# EAGLE design myUZE_final (EAGLE 7.5.0)
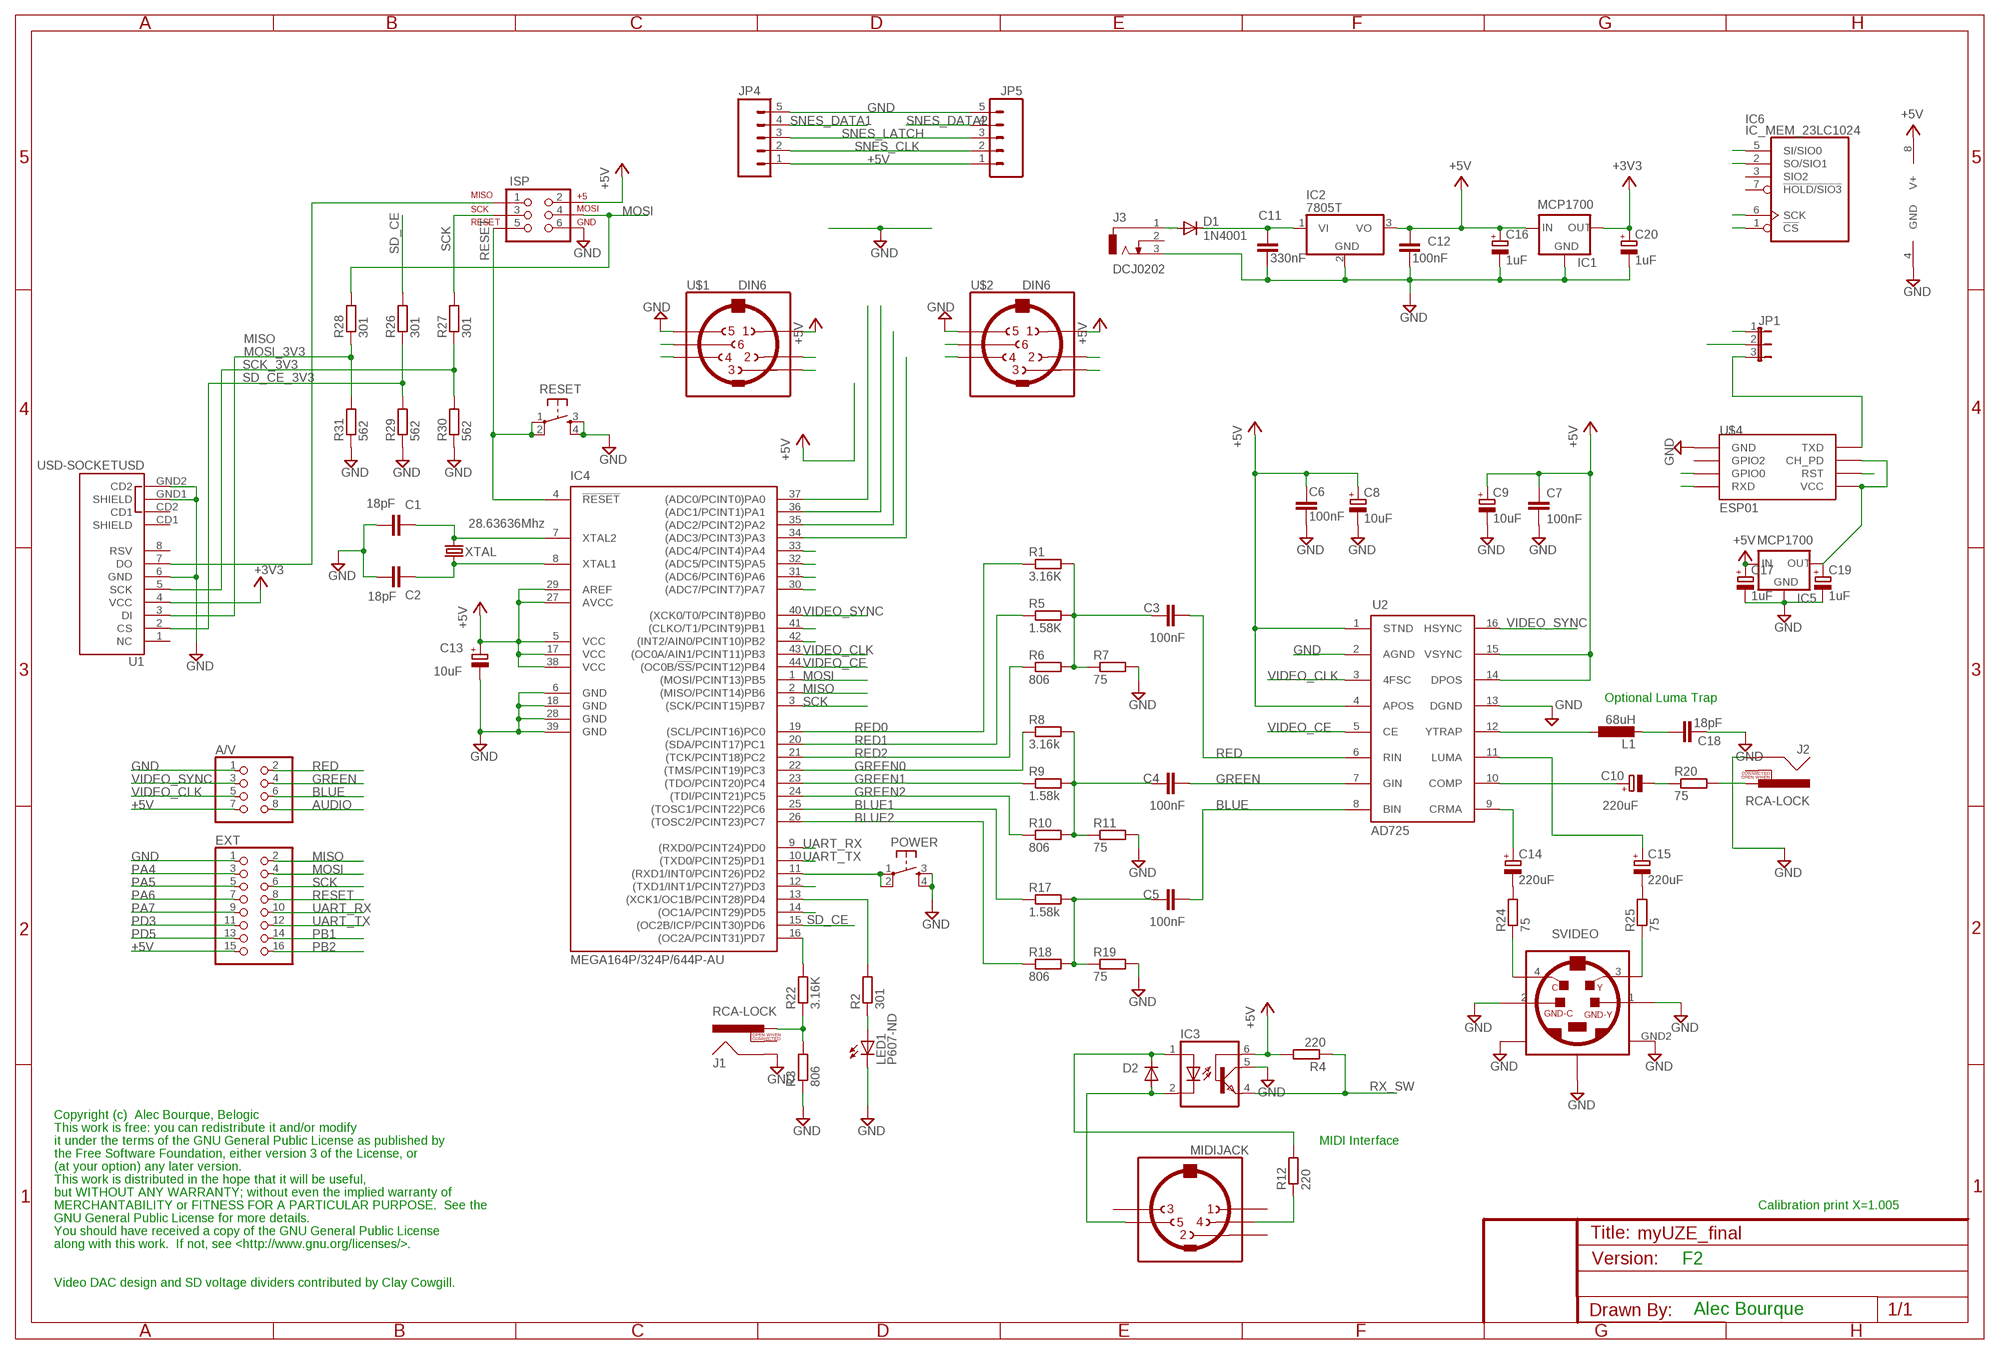
[diagram p0: schematic, sheet 1]

## Parts
A/V  PINHD-2X4  [2X04]
AD725  AD725  [SO16W]
C1  18pF  C-EUC0805  [C0805]
C2  18pF  C-EUC0805  [C0805]
C3  100nF  C-EUC0805  [C0805]
C4  100nF  C-EUC0805  [C0805]
C5  100nF  C-EUC0805  [C0805]
C6  100nF  C-EUC0805  [C0805]
C7  100nF  C-EUC0805  [C0805]
C8  10uF  CPOL-EU153CLV-0505  [153CLV-0505]
C9  10uF  CPOL-EU153CLV-0505  [153CLV-0505]
C10  220uF  CPOL-EUE2-5  [E2-5]
C11  330nF  C-EUC0805  [C0805]
C12  100nF  C-EUC0805  [C0805]
C13  10uF  CPOL-EU153CLV-0505  [153CLV-0505]
C14  220uF  CPOL-EUE2-5  [E2-5]
C15  220uF  CPOL-EUE2-5  [E2-5]
C16  1uF  CPOL-EU153CLV-0505  [153CLV-0505]
C17  1uF  CPOL-EU153CLV-0505  [153CLV-0505]
C18  18pF  C-EUC0805  [C0805]
C19  1uF  CPOL-EU153CLV-0505  [153CLV-0505]
C20  1uF  CPOL-EU153CLV-0505  [153CLV-0505]
D1  1N4001  DIODE-MELF-MLL41  [MELF-MLL41]
D2  DIODE-MINIMELF  [MINIMELF]
EXT  PINHD-2X8  [2X08]
IC1  MCP1700  MCP1700INLINE  [TO92-INLINE]
IC2  7805T  [TO220H]
IC3  PC110  [DIL06]
IC4  MEGA164P/324P/644P-AU  [TQFP44]
IC5  MCP1700  MCP1700INLINE  [TO92-INLINE]
IC6  IC_MEM_23LC1024  [SOIC-8]
ISP  AVR_SPI_PRG_6PTH  [2X3]
J1  RCA-LOCK  [RCA_LOCK]
J2  RCA-LOCK  [RCA_LOCK]
J3  DCJ0202  [DCJ0202]
JP1  JP2E  [JP2]
JP4  M05PTH  [1X05]
JP5  M05PTH  [1X05]
L1  68uH  L-EUIR-4  [IR-4]
LED1  P607-ND  LEDB155  [Q62902-B155]
POWER  USER  TAC_SWITCHPTH  [TACTILE-PTH]
R1  3.16K  R-EU_R0805  [R0805]
R2  301  R-EU_R0805  [R0805]
R3  806  R-EU_R0805  [R0805]
R4  220  R-EU_R0805  [R0805]
R5  1.58K  R-EU_R0805  [R0805]
R6  806  R-EU_R0805  [R0805]
R7  75  R-EU_R0805  [R0805]
R8  3.16k  R-EU_R0805  [R0805]
R9  1.58k  R-EU_R0805  [R0805]
R10  806  R-EU_R0805  [R0805]
R11  75  R-EU_R0805  [R0805]
R12  220  R-EU_R0805  [R0805]
R17  1.58k  R-EU_R0805  [R0805]
R18  806  R-EU_R0805  [R0805]
R19  75  R-EU_R0805  [R0805]
R20  75  R-EU_R0805  [R0805]
R22  3.16K  R-EU_R0805  [R0805]
R24  75  R-EU_R0805  [R0805]
R25  75  R-EU_R0805  [R0805]
R26  301  R-EU_R0805  [R0805]
R27  301  R-EU_R0805  [R0805]
R28  301  R-EU_R0805  [R0805]
R29  562  R-EU_R0805  [R0805]
R30  562  R-EU_R0805  [R0805]
R31  562  R-EU_R0805  [R0805]
RESET  RESET  TAC_SWITCHPTH  [TACTILE-PTH]
SVIDEO  S-VIDEO OUT  MINIDIN  [MINIDIN4]
U1  USD-SOCKETUSD  [USD-SOCKET-PP]
U$1  DIN6  [DIN6]
U$2  DIN6  [DIN6]
U$4  ESP01  [ESP01]
U$5  MIDIJACK  [CP-2350]
XTAL  28.63636Mhz  CRYSTALHC49S  [HC49/S]

## Nets
+3V3: C20.+ IC1.3(OUT) U1.4(VCC)
+5V: A/V.7 AD725.1(STND) AD725.4(APOS) AD725.14(DPOS) AD725.15(VSYNC) C6.1 C7.1 C8.+ C9.+ C12.1 C13.+ C16.+ C17.+ EXT.15 IC1.2(IN) IC2.3(VO) IC3.6(BAS) IC4.5(VCC) IC4.17(VCC) IC4.27(AVCC) IC4.29(AREF) IC4.38(VCC) IC5.2(IN) IC6.8(V+) ISP.2 JP4.1 JP5.1 R4.2 U$1.P1 U$2.P1
AUDIO: A/V.8 J1.PIN R3.2 R22.1
BLUE: A/V.6 AD725.8(BIN) C5.2
BLUE1: IC4.25((TOSC1/PCINT22)PC6) R17.1
BLUE2: IC4.26((TOSC2/PCINT23)PC7) R18.1
GND: A/V.1 AD725.2(AGND) AD725.13(DGND) C1.2 C2.2 C6.2 C7.2 C8.- C9.- C11.2 C12.2 C13.- C16.- C17.- C18.2 C19.- C20.- EXT.1 IC1.1(GND) IC2.2(GND) IC3.5(COL) IC4.6(GND) IC4.18(GND) IC4.28(GND) IC4.39(GND) IC5.1(GND) IC6.4(GND) ISP.6 J1.SHELL J2.SHELL J3.3 JP4.5 JP5.5 LED1.K(C) POWER.3 POWER.4 R3.1 R7.2 R11.2 R19.2 R29.1 R30.1 R31.1 RESET.3 RESET.4 SVIDEO.1(GND-Y) SVIDEO.2(GND-C) SVIDEO.GND1 SVIDEO.GND2 SVIDEO.GND3 U1.6(GND) U1.GND1(SHIELD) U1.GND2(CD2) U$1.P5 U$2.P5 U$4.GND
GREEN: A/V.4 AD725.7(GIN) C4.2
GREEN0: IC4.22((TMS/PCINT19)PC3) R8.1
GREEN1: IC4.23((TDO/PCINT20)PC4) R9.1
GREEN2: IC4.24((TDI/PCINT21)PC5) R10.1
MISO: EXT.2 IC4.2((MISO/PCINT14)PB6) IC6.2(SO/SIO1) ISP.1 U1.7(DO)
MOSI: EXT.4 IC4.1((MOSI/PCINT13)PB5) IC6.5(SI/SIO0) ISP.4 R28.2
MOSI_3V3: R28.1 R31.2 U1.3(DI)
N$1: AD725.12(YTRAP) L1.1
N$2: C18.1 L1.2
N$3: C5.1 R17.2 R18.2 R19.1
N$4: C4.1 R8.2 R9.2 R10.2 R11.1
N$5: C3.1 R1.2 R5.2 R6.2 R7.1
N$6: C10.- R20.1
N$7: AD725.10(COMP) C10.+
N$8: J2.PIN R20.2
N$9: C1.1 IC4.7(XTAL2) XTAL.2
N$10: D1.A J3.1
N$11: C14.- R24.2
N$12: C2.1 IC4.8(XTAL1) XTAL.1
N$13: IC4.16((OC2A/PCINT31)PD7) R22.2
N$14: D2.A IC3.2(C) U$5.5
N$16: D2.C IC3.1(A) R12.2
N$17: R12.1 U$5.4
N$18: U$1.P6
N$19: JP1.3 U$4.TX(TXD)
N$20: C11.1 D1.C IC2.1(VI)
N$21: C19.+ IC5.3(OUT) U$4.CH_PD U$4.VCC
N$23: IC4.13((XCK1/OC1B/PCINT28)PD4) R2.2
N$25: LED1.A R2.1
N$26: C15.- R25.2
N$27: U$2.P6
N$28: AD725.11(LUMA) C15.+
N$29: AD725.9(CRMA) C14.+
N$30: R24.1 SVIDEO.4(C)
N$31: R25.1 SVIDEO.3(Y)
PA4: EXT.3 IC4.33((ADC4/PCINT4)PA4) IC6.1(!CS)
PA5: EXT.5 IC4.32((ADC5/PCINT5)PA5)
PA6: EXT.7 IC4.31((ADC6/PCINT6)PA6)
PA7: EXT.9 IC4.30((ADC7/PCINT7)PA7) U$4.GPIO0
PB1: EXT.14 IC4.41((CLKO/T1/PCINT9)PB1)
PB2: EXT.16 IC4.42((INT2/AIN0/PCINT10)PB2)
PD3: EXT.11 IC4.12((TXD1/INT1/PCINT27)PD3) U$4.RST
PD5: EXT.13 IC4.14((OC1A/PCINT29)PD5)
POWER_SW: IC4.11((RXD1/INT0/PCINT26)PD2) POWER.1 POWER.2
RED: A/V.2 AD725.6(RIN) C3.2
RED0: IC4.19((SCL/PCINT16)PC0) R1.1
RED1: IC4.20((SDA/PCINT17)PC1) R5.1
RED2: IC4.21((TCK/PCINT18)PC2) R6.1
RESET: EXT.8 IC4.4(!RESET) ISP.5 RESET.1 RESET.2
RX_SW: IC3.4(EMI) JP1.1 R4.1
SCK: EXT.6 IC4.3((SCK/PCINT15)PB7) IC6.6(SCK) ISP.3 R27.2
SCK_3V3: R27.1 R30.2 U1.5(SCK)
SD_CE: IC4.15((OC2B/ICP/PCINT30)PD6) R26.2
SD_CE_3V3: R26.1 R29.2 U1.2(CS)
SNES_CLK: IC4.34((ADC3/PCINT3)PA3) JP4.2 JP5.2 U$1.P2 U$2.P2
SNES_DATA1: IC4.37((ADC0/PCINT0)PA0) JP4.4 U$2.P4
SNES_DATA2: IC4.36((ADC1/PCINT1)PA1) JP5.4 U$1.P4
SNES_LATCH: IC4.35((ADC2/PCINT2)PA2) JP4.3 JP5.3 U$1.P3 U$2.P3
UART_RX: EXT.10 IC4.9((RXD0/PCINT24)PD0) JP1.2
UART_TX: EXT.12 IC4.10((TXD0/PCINT25)PD1) U$4.RX(RXD)
VIDEO_CE: AD725.5(CE) IC4.44((OC0B/!SS!/PCINT12)PB4)
VIDEO_CLK: A/V.5 AD725.3(4FSC) IC4.43((OC0A/AIN1/PCINT11)PB3)
VIDEO_SYNC: A/V.3 AD725.16(HSYNC) IC4.40((XCK0/T0/PCINT8)PB0)
Unconnected: IC6.3(SIO2) IC6.7(!HOLD/SIO3) J1.SWITCH J2.SWITCH J3.2 U1.1(NC) U1.8(RSV) U1.CD1(SHIELD) U1.CD2(CD1) U$4.GPIO2 U$5.1 U$5.2 U$5.3 U$5.PE1(MT) U$5.PE2(MT) U$5.PE(MT) U$5.PE@(MT)

## Notes on the sheet
- Optional Luma Trap
- Copyright (c)  Alec Bourque, Belogic
- This work is free: you can redistribute it and/or modify
- it under the terms of the GNU General Public License as published by | MIDI Interface
- the Free Software Foundation, either version 3 of the License, or
- (at your option) any later version.
- This work is distributed in the hope that it will be useful,
- but WITHOUT ANY WARRANTY; without even the implied warranty of
- MERCHANTABILITY or FITNESS FOR A PARTICULAR PURPOSE.  See the | Calibration print X=1.005
- GNU General Public License for more details.
- You should have received a copy of the GNU General Public License
- along with this work.  If not, see <http://www.gnu.org/licenses/>.
- F2
- Video DAC design and SD voltage dividers contributed by Clay Cowgill.
- Alec Bourque

## Library data of the parts
A/V = pinhead:PINHD-2X4: PIN HEADER
AD725 = ad725:AD725; IC_NO: U2
C1-C7 C11 C12 C18 = rcl:C-EU: CAPACITOR, European symbol
C8-C10 C13-C17 C19 C20 = rcl:CPOL-EU: POLARIZED CAPACITOR, European symbol
D1 = diode:DIODE-: DIODE; PN: 641-1310-1-ND
D2 = diode:DIODE-: DIODE
EXT = pinhead:PINHD-2X8: PIN HEADER
IC1 IC5 = adafruit:MCP1700: VOLTAGE REGULATOR; DPN: MCP1700-3302E/TO-ND
IC2 = adafruit:78*: Positive VOLTAGE REGULATOR Added bigger pads to the TO-92 package; DPN: LM7805ACT-ND
IC3 = optocoupler:PC110: SHARP OPTO COUPLER; OC_FARNELL: unknown; OC_NEWARK: unknown
IC4 = avr-7:MEGA164P/324P/644P-AU
IC6 = dp_devices:IC_MEM_23LC1024: 1Mbit SPI SRAM with Serial dual interface and Serial quad interface
ISP = SparkFun:AVR_SPI_PRG_6: AVR ISP 6 Pin This is the reduced ISP connector for AVR programming. Common on Arduino. This footprint will take up less PCB space and can be used with a 10-pin to 6-pin adapter such as SKU: BOB-08508; PN: 609-2436-ND
J1 J2 = SparkFun-Connectors:RCA
J3 = con-jack-igi:DCJ0202: DC POWER JACK Source: DCJ0202.pdf; OC_FARNELL: unknown; OC_NEWARK: unknown
JP1 = jumper:JP2E: JUMPER
JP4 JP5 = SparkFun:M05: Header 5 Standard 5-pin 0.1" header. Use with straight break away headers (SKU : PRT-00116), right angle break away headers (PRT-00553), swiss pins (PRT-00743), machine pins (PRT-00117), and female headers (PRT-00115). Molex polarized connector foot print use with SKU : PRT-08230 with associated crimp pins and housings.
L1 = rcl:L-EU: INDUCTOR, European symbol
LED1 = led-igi:LED: LED OSRAM: - CHIPLED LG R971, LG N971, LY N971, LG Q971, LY Q971, LO R971, LY R971 LH N974, LH R974 LS Q976, LO Q976, LY Q976 LO Q996 - Hyper CHIPLED LW Q18S LB Q993, LB Q99A, LB R99A - SideLED LS A670, LO A670, LY A670, LG A670, LP A670 LB A673, LV A673, LT A673, LW A673 LH A674 LY A675 LS A676, LA A676, LO A676, LY A676, LW A676 LS A679, LY A679, LG A679 - Hyper Micro SIDELED® LS Y876, LA Y876, LO Y876, LY Y876 LT Y87S - SmartLED LW L88C, LW L88S LB L89C, LB L89S, LG L890 LS L89K, LO L89K, LY L89K LS L896, LA L896, LO L896, LY L896 - TOPLED LS T670, LO T670, LY T670, LG T670, LP T670 LSG T670, LSP T670, LSY T670, LOP T670, LYG T670 LG T671, LOG T671, LSG T671 LB T673, LV T673, LT T673, LW T673 LH T674 LS T676, LA T676, LO T676, LY T676, LB T676, LH T676, LSB T676, LW T676 LB T67C, LV T67C, LT T67C, LS T67K, LO T67K, LY T67K, LW E67C LS E67B, LA E67B, LO E67B, LY E67B, LB E67C, LV E67C, LT E67C LW T67C LS T679, LY T679, LG T679 LS T770, LO T770, LY T770, LG T770, LP T770 LB T773, LV T773, LT T773, LW T773 LH T774 LS E675, LA E675, LY E675, LS T675 LS T776, LA T776, LO T776, LY T776, LB T776 LHGB T686 LT T68C, LB T68C - Hyper Mini TOPLED® LB M676 - Mini TOPLED Santana® LG M470 LS M47K, LO M47K, LY M47K Source: http://www.osram.convergy.de LUXEON: - LUMILED® LXK2-PW12-R00, LXK2-PW12-S00, LXK2-PW14-U00, LXK2-PW14-V00 LXK2-PM12-R00, LXK2-PM12-S00, LXK2-PM14-U00 LXK2-PE12-Q00, LXK2-PE12-R00, LXK2-PE12-S00, LXK2-PE14-T00, LXK2-PE14-U00 LXK2-PB12-K00, LXK2-PB12-L00, LXK2-PB12-M00, LXK2-PB14-N00, LXK2-PB14-P00, LXK2-PB14-Q00 LXK2-PR12-L00, LXK2-PR12-M00, LXK2-PR14-Q00, LXK2-PR14-R00 LXK2-PD12-Q00, LXK2-PD12-R00, LXK2-PD12-S00 LXK2-PH12-R00, LXK2-PH12-S00 LXK2-PL12-P00, LXK2-PL12-Q00, LXK2-PL12-R00 Source: www.luxeon.com KINGBRIGHT: KA-3528ASYC Source: www.kingbright.com
POWER RESET = SparkFun:TAC_SWITCH: Momentary Switch Button commonly used for reset or general input. Spark Fun Electronics SKU : COM-00097; PN: P8006S-ND
R1-R12 R17-R20 R22 R24-R31 = rcl:R-EU_: RESISTOR, European symbol
SVIDEO = mini-din4:MINIDIN: mini-din 4 connector; PN: CP-2240-ND
U1 = SparkFun-Connectors-igi:USD-SOCKET: microSD Socket Push-push type uSD socket. Schematic element and footprint production proven. Spark Fun Electronics SKU : PRT-00127. tDoc lines correctly indicate media card edge positions when inserting (unlocked, locked, depressed). NOTE: CD1 and CD2 are connected internally
U$1 U$2 = con-igi:DIN6
U$4 = esp8266modules:ESP01: ESP8266 Wifi module 01
U$5 = adafruit:MIDIJACK: DIN 5 jack also known as MIDI jack A modification of conn-hirshman:MAB5SH with two options for the grounding 'teeth'; PN: CP-2350-ND
XTAL = adafruit:CRYSTAL: CRYSTAL; OC_FARNELL: 1667008; OC_NEWARK: unknown; PN: 887-1256-ND

## Board
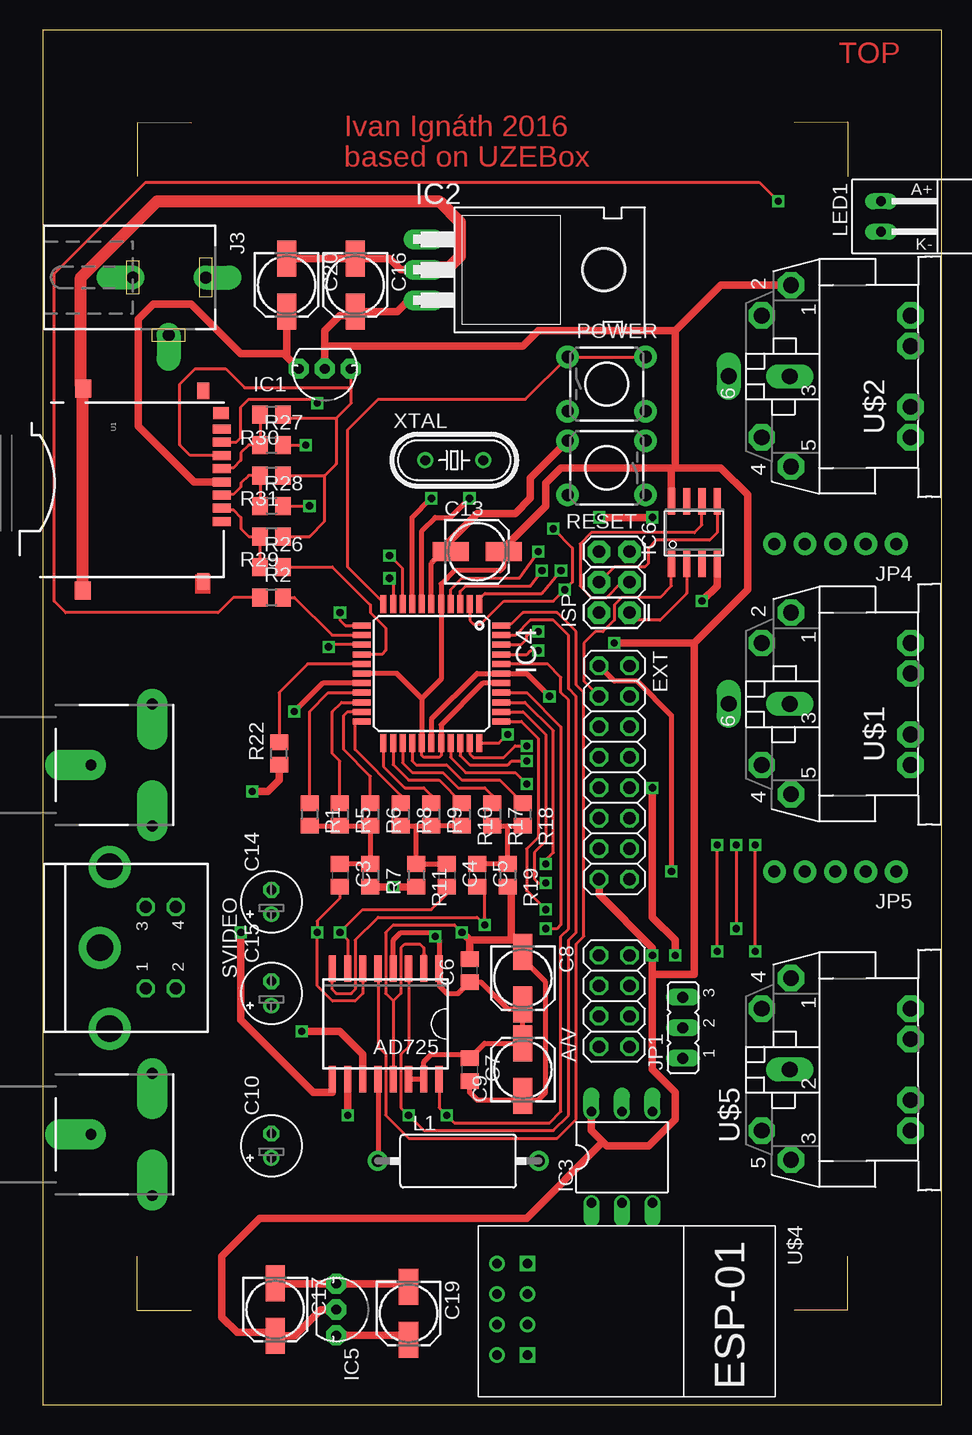
[diagram p1: board, top side]
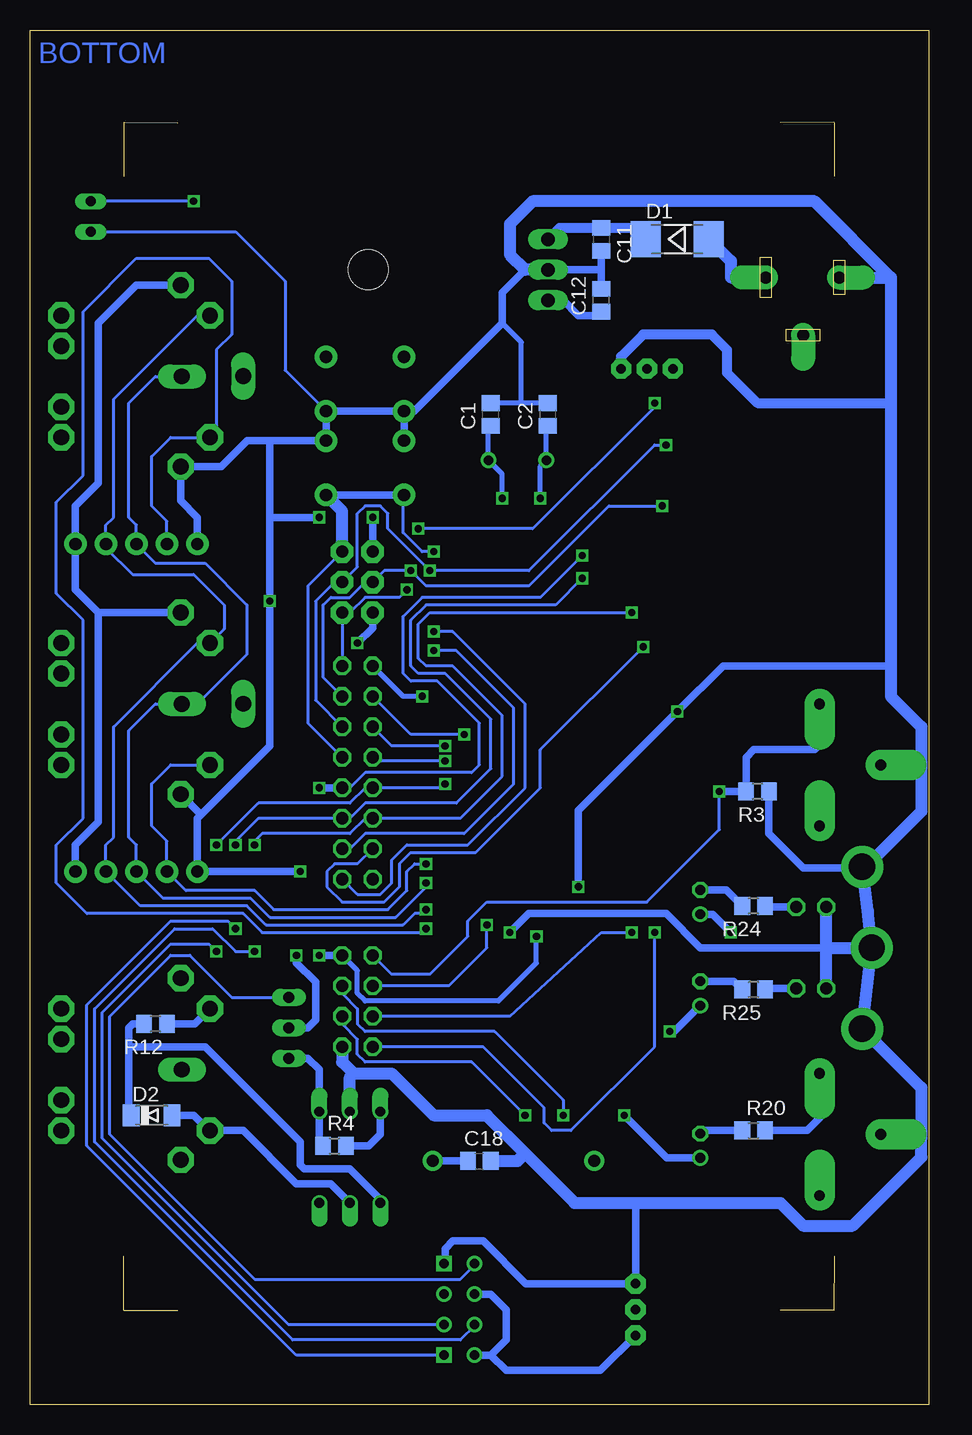
[diagram p2: board, bottom side, seen from below]

Size 74.91 x 114.61 mm. Coordinates in mm from the lower left corner, seen from the top.
Outline: 7.88,106.89 7.88,102.41
Outline: 7.89,106.9 12.38,106.89
Outline: 7.87,12.38 7.88,7.89 12.38,7.89
Outline: 62.62,7.88 67.09,7.88 67.09,12.38
Outline: 62.62,106.89 67.09,106.9 67.09,102.41
Outline: 0,0 74.91,0 74.91,114.6 0,114.6 0,0
Copper layers (1*16): Top 0.035mm / dielectric 1.5mm / Bottom 0.035mm
Design rules "default": minimum track width 10mil, minimum drill 24mil, track to track 8mil, track to pad 8mil, pad to pad 8mil, via to via 8mil, smd to smd 8mil, copper to edge 40mil, drill to drill 8mil, minimum pad ring 10mil, minimum via ring 8mil, stop-mask expansion 4mil, vias tented up to drill 0mil, thermal gap 10mil

### Footprints (pad centres in the part's own frame; a part is rotated, then mirrored left to right if it is on the bottom)
2X04 = drill 1.016 octagon: 1 -3.81,-1.27; 2 -3.81,1.27; 3 -1.27,-1.27; 4 -1.27,1.27; 5 1.27,-1.27; 6 1.27,1.27; 7 3.81,-1.27; 8 3.81,1.27
SO16W = smd 0.6 x 2.2: 1 -4.445,-4.6; 2 -3.175,-4.6; 3 -1.905,-4.6; 4 -0.635,-4.6; 5 0.635,-4.6; 6 1.905,-4.6; 7 3.175,-4.6; 8 4.445,-4.6; 9 4.445,4.6; 10 3.175,4.6; 11 1.905,4.6; 12 0.635,4.6; 13 -0.635,4.6; 14 -1.905,4.6; 15 -3.175,4.6; 16 -4.445,4.6
C0805 = smd 1.3 x 1.5: 1 -0.95,0; 2 0.95,0
153CLV-0505 = smd 3 x 1.6: + 2.2,0; - -2.2,0
E2-5 = drill 0.813 pad 1.27: + -1.016,0 | drill 0.813 pad 1.27 octagon: - 1.016,0
MELF-MLL41 = smd 2.5 x 3: A 2.625,0; C -2.625,0
MINIMELF = smd 1.4 x 1.8: A 1.7,0; C -1.7,0
2X08 = drill 1.016 octagon: 1 -8.89,-1.27; 2 -8.89,1.27; 3 -6.35,-1.27; 4 -6.35,1.27; 5 -3.81,-1.27; 6 -3.81,1.27; 7 -1.27,-1.27; 8 -1.27,1.27; 9 1.27,-1.27; 10 1.27,1.27; 11 3.81,-1.27; 12 3.81,1.27; 13 6.35,-1.27; 14 6.35,1.27; 15 8.89,-1.27; 16 8.89,1.27
TO92-INLINE = drill 0.813 pad 1.676 octagon: 1 -2.159,0; 2 0,0; 3 2.159,0
TO220H = drill 1.118 long: 1 -2.54,-10.16; 2 0,-10.16; 3 2.54,-10.16 | hole 3.302: 0,4.826
DIL06 = drill 0.813 offset: 1 -2.54,-3.81; 2 0,-3.81; 3 2.54,-3.81; 4 2.54,3.81; 5 0,3.81; 6 -2.54,3.81
TQFP44 = smd 1.5 x 0.5: 1 -5.8,4; 2 -5.8,3.2; 3 -5.8,2.4; 4 -5.8,1.6; 5 -5.8,0.8; 6 -5.8,0; 7 -5.8,-0.8; 8 -5.8,-1.6; 9 -5.8,-2.4; 10 -5.8,-3.2; 11 -5.8,-4; 23 5.8,-4; 24 5.8,-3.2; 25 5.8,-2.4; 26 5.8,-1.6; 27 5.8,-0.8; 28 5.8,0; 29 5.8,0.8; 30 5.8,1.6; 31 5.8,2.4; 32 5.8,3.2; 33 5.8,4 | smd 0.5 x 1.5: 12 -4,-5.8; 13 -3.2,-5.8; 14 -2.4,-5.8; 15 -1.6,-5.8; 16 -0.8,-5.8; 17 0,-5.8; 18 0.8,-5.8; 19 1.6,-5.8; 20 2.4,-5.8; 21 3.2,-5.8; 22 4,-5.8; 34 4,5.8; 35 3.2,5.8; 36 2.4,5.8; 37 1.6,5.8; 38 0.8,5.8; 39 0,5.8; 40 -0.8,5.8; 41 -1.6,5.8; 42 -2.4,5.8; 43 -3.2,5.8; 44 -4,5.8
SOIC-8 = smd 0.6 x 2.2: 1 -1.905,-2.6; 2 -0.635,-2.6; 3 0.635,-2.6; 4 1.905,-2.6; 5 1.905,2.6; 6 0.635,2.6; 7 -0.635,2.6; 8 -1.905,2.6
2X3 = drill 1.016 pad 1.88 octagon: 1 0,0; 2 0,2.54; 3 2.54,0; 4 2.54,2.54; 5 5.08,0; 6 5.08,2.54
RCA_LOCK = drill 0.9 pad 2.54 offset: PIN 4.03,5.072; SHELL -1.067,0; SWITCH 4.03,-5.097
DCJ0202 = drill 1 pad 2 offset: 1 0,3.1; 2 4.8,0; 3 0,-3
JP2 = drill 0.914 long: 1 -2.54,0; 2 0,0; 3 2.54,0
1X05 = drill 1.016 pad 1.88: 1 0,0; 2 2.54,0; 3 5.08,0; 4 7.62,0; 5 10.16,0
IR-4 = drill 1 pad 1.676: 1 -6.705,0; 2 6.73,0
Q62902-B155 = drill 0.813 long: A 7.62,-1.27; K 7.62,1.27
TACTILE-PTH = drill 1.016 pad 1.88: 1 -3.251,2.261; 2 3.251,2.261; 3 -3.251,-2.261; 4 3.251,-2.261
R0805 = smd 1.3 x 1.5: 1 -0.95,0; 2 0.95,0
MINIDIN4 = drill 1 octagon: 1 -3.4,-3.8; 2 3.4,-3.8; 3 -3.4,-6.3; 4 3.4,-6.3 | drill 2.2 pad 3.5: GND1 -6.75,-0.8; GND2 0,0; GND3 6.75,-0.8
USD-SOCKET-PP = smd 0.75 x 1.5: 1 3.2,16.8; 2 2.1,16.8; 3 1,16.8; 4 -0.1,16.8; 5 -1.2,16.8; 6 -2.3,16.8; 7 -3.4,16.8; 8 -4.5,16.8 | smd 1 x 1.3: CD1 -5.85,16.75 | smd 1.4 x 1: CD2 -7.695,15.295; CD3 8.18,15.295 | smd 1.5 x 1.35: GND1 -7.862,5.285; GND2 8.963,5.237
DIN6 = drill 1.321 pad 2.184 octagon: P1 7.62,1.15; P2 5.08,3.59; P4 -5.08,3.59; P5 -7.52,1.15; PE -2.54,-8.81; PE1 -5.08,-8.81; PE2 5.08,-8.81; PE@ 2.54,-8.81 | drill 1.321 long: P3 0,1.25; P6 0.02,6.35
ESP01 = drill 0.8: CH_PD -1.285,-8.178; GPIO0 1.255,-5.638; GPIO2 -1.285,-5.638; RST 1.255,-8.178; TX -3.825,-8.178; VCC 3.795,-8.178 | drill 0.8 square: GND -3.825,-5.638; RX 3.795,-5.638
CP-2350 = drill 1.321 pad 2.184 octagon: 1 7.62,12.58; 3 -7.52,12.58; 4 5.08,15.02; 5 -5.08,15.02; PE -2.54,2.62; PE1 -5.08,2.62; PE2 5.08,2.62; PE@ 2.54,2.62 | drill 1.321 long: 2 0,12.68
HC49/S = drill 0.813: 1 -2.413,0; 2 2.413,0

### Placement (x,y rotation side)
A/V  47.62,33.65 90 top
AD725  28.57,31.75 180 top
C1  36.51,82.55 90 bottom
C2  31.75,82.55 90 bottom
C3  24.77,44.13 270 top
C4  33.65,44.13 270 top
C5  36.2,44.13 270 top
C6  35.56,36.2 90 top
C7  35.56,27.94 270 top
C8  40,35.56 270 top
C9  40,27.94 90 top
C10  19.05,21.59 90 top
C11  27.3,97.16 270 bottom
C12  27.3,92.08 90 bottom
C13  36.2,71.12 0 top
C14  19.05,41.91 90 top
C15  19.05,34.29 90 top
C16  26.04,93.34 270 top
C17  19.37,7.94 270 top
C18  37.46,20.32 0 bottom
C19  30.48,7.62 270 top
C20  20.32,93.34 270 top
D1  20.96,97.16 0 bottom
D2  64.77,24.13 0 bottom
EXT  47.62,52.7 270 top
IC1  23.5,86.36 180 top
IC2  41.91,94.62 270 top
IC3  48.26,20.64 0 top
IC4  32.38,60.96 270 top
IC5  24.45,7.94 270 top
IC6  54.29,72.71 0 top
ISP  48.89,66.04 90 top
J1  5.08,53.34 0 top
J2  5.08,22.54 0 top
J3  10.48,93.98 270 top
JP1  53.34,31.43 90 top
JP4  71.12,71.76 180 top
JP5  71.12,44.45 180 top
L1  34.61,20.32 0 top
LED1  77.47,99.06 180 top
POWER  46.99,85.09 0 top
R1  22.23,49.21 270 top
R2  19.05,67.31 0 top
R3  14.29,51.12 180 bottom
R4  49.53,21.59 0 bottom
R5  24.77,49.21 270 top
R6  27.3,49.21 270 top
R7  27.3,44.13 270 top
R8  29.85,49.21 270 top
R9  32.38,49.21 270 top
R10  34.92,49.21 270 top
R11  31.12,44.13 270 top
R12  64.45,31.75 180 bottom
R17  37.46,49.21 270 top
R18  40,49.21 270 top
R19  38.73,44.13 270 top
R20  14.6,22.86 0 bottom
R22  19.69,54.29 90 top
R24  14.6,41.59 180 bottom
R25  14.6,34.61 180 bottom
R26  19.05,69.85 0 top
R27  19.05,80.01 0 top
R28  19.05,74.93 0 top
R29  19.05,72.39 180 top
R30  19.05,82.55 180 top
R31  19.05,77.47 180 top
RESET  46.99,78.11 180 top
SVIDEO  4.76,38.1 90 top
U1  -1.9,76.84 270 top
U$1  63.5,58.42 90 top
U$2  63.5,85.73 90 top
U$4  46.04,7.94 270 top
U$5  74.93,27.94 90 top
XTAL  34.29,78.74 0 top

### Tracks (layer width: path | path; a pad name or v marks a point on that pad's centre or on a via)
+3V3
  Top 0.61: U1.4 12.6,76.93 7.94,81.6 7.94,90.49 9.21,91.76 12.38,91.76 16.51,87.63 20.07,87.63 20.32,87.38 | C20.+ 20.32,87.38 | 20.32,87.38 IC1.3
+5V  (via drill 0.6)
  Top 0.254: IC4.29 33.18,54.14 33.02,53.97 31.75,53.97 31.58,54.14 IC4.27
  Top 0.406: AD725.14 AD725.15 31.75,28.57 32.39,29.21 35.24,29.21 C7.1 36.81,30.14 C9.+ C8.+ 39.67,33.02 38.74,33.02 36.51,35.24 C6.1 34.6,34.29 33.65,34.29 33.02,34.92 AD725.1 33.02,38.74 v32.7,39.05 32.39,39.37 29.85,39.37 29.21,38.74 AD725.4 | C13.+ 38.39,69.83 38.1,69.53 34.29,69.53 33.18,68.43 IC4.5 33.18,60.49 31.58,58.89 | IC4.38 36.67,60.16 33.18,56.68 IC4.29 | 31.58,58.89 IC4.27 | 31.58,58.89 29.51,60.96 IC4.17
  Top 0.61: 23.49,88.26 23.49,89.54 24.76,90.81 25.69,90.81 C16.+ 29.55,91.15 30.48,92.07 IC2.3 | EXT.15 46.35,42.54 50.8,38.1 v50.8,37.46 50.8,35.88 | IC1.2 23.49,88.26 | 23.49,88.26 40,88.26 41.28,89.54 52.71,89.54 | 52.71,78.1 52.39,78.1 | C13.+ 38.74,71.46 38.74,71.76 41.91,74.93 41.91,76.84 43.18,78.1 52.39,78.1 | IC3.6 45.72,22.86 46.67,21.91 | 46.67,21.91 46.99,21.59 50.48,21.59 52.71,23.81 52.71,26.03 50.8,27.94 50.8,35.88 | v47.63,63.5 54.29,63.5 | 52.71,78.1 52.71,89.54 | U$2.P1 56.52,93.34 52.71,89.54 | 54.29,63.5 54.29,35.88 50.8,35.88 | 46.67,21.91 40.32,15.56 18.1,15.56 14.92,12.38 14.92,7.3 16.19,6.03 19.07,6.03 C17.+ 20.98,5.74 23.18,7.94 IC5.2 | 52.71,78.1 56.52,78.1 58.74,75.88 58.74,67.95 54.29,63.5 | IC6.8 52.39,78.1
  Bottom 0.406: v32.7,39.05 32.7,36.83 35.88,33.65 46.99,33.65 47.63,34.29 47.63,36.2 A/V.7
  Bottom 0.61: IC2.3 30.48,92.07 29.21,90.81 27.62,90.81 C12.1 | A/V.7 v50.8,37.46 | ISP.2 46.35,64.77 v47.63,63.5 | JP5.1 71.12,46.67 69.21,48.58 69.21,66.04 | U$2.P1 66.04,93.34 69.21,90.17 69.21,76.84 71.12,74.93 JP4.1 71.12,67.95 69.21,66.04 | U$1.P1 69.21,66.04 | R4.2 46.67,21.59 45.72,22.54 IC3.6
AUDIO  (via drill 0.6)
  Top 0.61: R22.1 19.69,52.07 18.73,51.12 v17.46,51.12
  Bottom 0.254: v17.46,51.12 17.46,47.94 23.49,41.91 36.83,41.91 38.42,40.32 38.42,39.05 41.59,35.88 44.77,35.88 A/V.8
  Bottom 0.61: J1.PIN 8.89,58.19 8.89,55.24 9.52,54.61 14.6,54.61 15.24,53.98 R3.2 v17.46,51.12
BLUE  (via drill 0.6)
  Top 0.254: AD725.8 24.13,34.61 24.45,34.29 25.72,34.29 26.03,34.61 26.03,38.74 27.94,40.64 36.2,40.64 v36.83,40 36.83,42.55 C5.2
  Bottom 0.254: v36.83,40 36.83,38.1 40,34.92 A/V.6
BLUE1
  Top 0.254: IC4.25 29.98,53.52 30.8,52.71 33.34,52.71 34.61,51.43 36.83,51.43 37.46,50.8 R17.1
BLUE2
  Top 0.254: IC4.26 30.78,53.67 31.12,53.34 33.65,53.34 34.92,52.07 38.1,52.07 R18.1
GND  (via drill 0.6)
  Top 0.254: 29.21,33.65 28.57,34.29 28.57,39.37 29.21,40 34.29,40 v34.92,39.37 | 29.21,33.65 29.85,34.29 29.85,38.1 30.16,38.42 31.43,38.42 31.75,38.1 31.75,37.46 | 29.21,33.65 AD725.13 | U1.6 12.31,79.14 11.43,80.01 11.43,85.09 12.7,86.36 15.24,86.36 16.83,84.77 25.72,84.77 | R30.1 20.32,82.23 24.45,82.23 | R29.1 22.23,72.39 23.49,73.66 23.49,77.47 | R31.1 23.49,77.47 | 24.45,82.23 25.72,83.5 25.72,84.77 | 25.72,84.77 25.72,86.3 IC1.1 | R11.2 29.85,43.18 v29.21,43.18 | 39.05,42.86 R19.2 | 24.45,82.23 24.45,78.42 23.81,77.79 23.49,77.47
  Top 0.406: C7.2 35.56,26.03 36.2,25.4 39.67,25.4 | AD725.2 31.75,37.46 | 39.67,25.4 41.28,25.4 41.91,26.03 41.91,35.24 40,37.15 C8.- 40.3,37.46 | 39.67,25.4 C9.- | IC4.6 32.39,70.17 33.34,71.12 C13.- | v52.39,44.45 52.39,57.47 49.53,60.32 47.63,60.32 EXT.1 | IC4.28 32.39,57.15 36.2,60.96 IC4.39 40.32,60.96 v42.23,59.06 | IC4.18 23.33,60.16 v20.96,57.78
  Top 0.61: R11.2 R7.2 | C20.- C16.- 28.92,95.54 29.85,94.62 IC2.2 | C8.- 40,38.74 39.05,38.74 | 39.05,38.74 35.56,38.74 | 35.56,38.74 v34.92,39.37 | 35.56,38.74 C6.2 | 33.34,71.12 33.34,71.44 36.2,74.29 39.37,74.29 40.64,75.56 40.64,77.27 RESET.4 | C17.- 19.41,10.1 IC5.1 30.2,10.1 C19.- | IC6.4 56.2,68.26 v54.93,66.99 | 39.05,42.86 39.05,38.74 | v46.35,73.98 v50.8,73.98
  Top 1.016: U1.GND2 3.33,84.65 U1.GND1 3.18,84.9 3.18,93.98 9.52,100.33 33.02,100.33 34.77,98.58 34.77,95.73 33.81,94.77 31.91,94.77 IC2.2
  Bottom 0.254: LED1.K 57.78,97.79 53.66,93.66 53.66,86.25 POWER.4 | J1.SHELL 0.95,53.34 0.64,53.02
  Bottom 0.406: C1.2 C2.2 33.97,83.5 33.97,88.58 35.56,90.17 | v42.23,59.06 43.82,59.06 EXT.1
  Bottom 0.61: IC2.2 27.3,94.62 | 27.3,94.62 C11.2 | 27.3,94.62 C12.2 | v34.92,39.37 33.34,40.96 21.91,40.96 19.05,38.1 8.56,38.1 | POWER.3 POWER.4 RESET.3 | RESET.4 POWER.3 | v29.21,43.18 29.21,49.53 v20.96,57.78 17.14,61.6 3.18,61.6 | POWER.3 42.9,82.83 35.56,90.17 35.56,92.71 33.65,94.62 | v52.39,44.45 JP5.5 60.96,48.89 60.64,49.21 | RESET.3 54.93,80.37 | 54.93,80.37 56.79,80.37 58.96,78.2 U$2.P5 62.35,75.37 60.96,73.98 JP4.5 | 60.64,49.21 54.93,54.93 v54.93,66.99 54.93,73.98 | U$1.P5 60.66,49.21 60.64,49.21 | 54.93,73.98 54.93,80.37 | 24.45,16.83 IC5.1 33.59,10.1 37.15,13.65 39.69,13.65 40.32,13.02 40.32,11.84 U$4.GND | 50.2,80.33 RESET.3 | ISP.6 v46.35,73.98 | v50.8,73.98 54.93,73.98 | R3.1 13.34,47.63 10.48,44.77 5.65,44.77 SVIDEO.GND3
  Bottom 0.813: IC1.1 25.65,87.38 23.81,89.22 18.1,89.22 16.83,87.95 16.83,86.04 14.29,83.5 3.18,83.5
  Bottom 1.016: J3.3 3.18,93.98 | 3.18,93.98 9.52,100.33 33.02,100.33 34.92,98.43 34.92,95.89 33.65,94.62 IC2.2 | 3.18,93.98 3.18,83.5 3.18,61.6 3.18,59.06 0.64,56.52 0.64,53.02 0.64,49.46 5.24,44.85 SVIDEO.GND3 5.08,41.19 SVIDEO.GND2 | SVIDEO.1 8.56,38.1 | 8.56,38.1 SVIDEO.2 | 8.56,38.1 SVIDEO.GND2 | SVIDEO.GND2 SVIDEO.GND1 0.64,26.42 0.64,22.54 0.95,22.54 | 0.95,22.54 J2.SHELL | A/V.1 48.89,28.57 47.94,27.62 | 47.94,27.62 44.77,27.62 41.28,24.13 36.83,24.13 33.65,20.96 | 33.65,20.96 29.53,16.83 24.45,16.83 12.38,16.83 10.48,14.92 6.35,14.92 0.64,20.64 0.64,22.23 0.95,22.54 | C18.2 34.29,20.32 33.65,20.96 | IC3.5 48.26,27.3 47.94,27.62
GREEN  (via drill 0.6)
  Top 0.254: AD725.7 25.4,38.74 v24.76,39.37 26.67,41.28 32.39,41.28 33.65,42.54 C4.2
  Bottom 0.254: v24.76,39.37 27.3,39.37 34.92,32.39 A/V.4
GREEN0
  Top 0.254: R8.1 29.85,50.8 26.03,54.61 26.03,56.83 26.46,56.83 IC4.22
GREEN1
  Top 0.254: IC4.23 28.39,53.21 30.16,51.43 31.75,51.43 32.39,50.8 R9.1
GREEN2
  Top 0.254: IC4.24 29.19,53.36 30.48,52.07 33.02,52.07 R10.1
MISO  (via drill 0.6)
  Top 0.254: IC4.2 35.59,65.38 35.88,65.09 36.51,65.09 38.42,66.99 42.54,66.99 v43.5,67.95 44.13,68.58 44.13,71.44 v42.54,73.03 | U1.7 16.1,80.23 16.51,80.65 16.51,83.18 17.14,83.82 22.86,83.82 v22.86,83.5 | IC6.2 53.66,67.63 51.43,65.4 49.53,65.4 ISP.1
  Bottom 0.254: v43.5,67.95 44.13,67.31 46.99,67.31 48.26,66.04 ISP.1 EXT.2 | v42.54,73.03 33.02,73.03 22.86,83.18 v22.86,83.5
MOSI  (via drill 0.6)
  Top 0.254: IC4.1 36.51,66.89 36.51,67.31 36.83,67.63 41.59,67.63 v43.18,69.53 | R28.2 v22.23,74.93 | IC6.5 56.2,72.71 55.56,72.07 51.12,72.07 50.48,71.44 50.48,70.17 50.17,69.85 47.63,69.85 ISP.4
  Bottom 0.254: EXT.4 50.48,60.64 50.48,66.68 49.85,67.31 48.26,67.31 46.99,68.58 ISP.4 45.4,69.53 v43.18,69.53 41.91,68.26 33.34,68.26 26.67,74.93 v22.23,74.93
MOSI_3V3
  Top 0.254: U1.3 14.94,75.88 15.87,75.88 16.51,76.52 16.51,76.84 17.14,77.47 R31.2 R28.1
N$1
  Top 0.254: 27.94,20.36 L1.1
  Top 0.406: AD725.12 27.94,20.36
N$2
  Bottom 0.61: L1.2 C18.1
N$3
  Top 0.406: C5.1 R19.1 38.74,48.26 | 38.74,48.26 R18.2 | R17.2 38.74,48.26
N$4
  Top 0.254: R10.2 34.92,47.94
  Top 0.406: R10.2 R9.2 | C4.1 R11.1 31.12,48.26 R9.2 | R8.2 R9.2
N$5
  Top 0.406: R1.2 R5.2 R6.2 R7.1 C3.1
N$6
  Bottom 0.61: R20.1 18.8,22.86 C10.-
N$7  (via drill 0.6)
  Top 0.61: v25.4,24.13 AD725.10
  Bottom 0.61: C10.+ 21.84,20.57 v25.4,24.13
N$8
  Bottom 0.61: J2.PIN 9.11,23.91 10.16,22.86 R20.2
N$9  (via drill 0.6)
  Top 0.406: IC4.7 31.58,72.86 32.7,73.98 33.97,73.98 v35.56,75.56
  Bottom 0.406: v35.56,75.56 35.56,77.6 XTAL.2 36.7,81.41 C1.1
N$10
  Bottom 1.016: D1.A 16.51,95.34 16.51,93.98 J3.1
N$11
  Bottom 0.61: R24.2 16.89,42.93 C14.-
N$12  (via drill 0.6)
  Top 0.406: IC4.8 30.78,73.96 v32.39,75.56
  Bottom 0.406: v32.39,75.56 32.39,78.23 XTAL.1 31.88,81.47 C2.1
N$13
  Top 0.254: IC4.16 22.07,61.76 19.69,59.37 R22.2
N$14
  Bottom 0.61: IC3.2 49.85,18.42 52.71,18.42 57.15,22.86 U$5.5 60.01,22.86 61.28,24.13 D2.A
N$16
  Bottom 0.61: IC3.1 45.72,17.14 48.26,19.69 52.07,19.69 52.39,20 52.39,21.91 60.32,29.85 66.68,29.85 | 66.68,29.85 66.68,31.43 66.36,31.75 R12.2 | 66.68,29.85 66.68,24.33 D2.C
N$17
  Bottom 0.61: R12.1 61.18,31.75 U$5.4
N$19
  Bottom 0.254: JP1.3 58.1,33.97 61.6,37.46 63.18,37.46 68.26,32.39 68.26,22.54 56.2,10.48 39.05,10.48 37.86,11.67 U$4.TX
N$20
  Bottom 0.813: IC2.1 30.8,98.1 C11.1 24.53,98.11 D1.C
N$21
  Top 0.61: IC5.3 30.12,5.78 C19.+
  Bottom 0.61: U$4.CH_PD 36.53,9.22 35.24,7.94 35.24,5.4 36.51,4.13 | 36.51,4.13 37.85,4.13 U$4.VCC 36.53,4.14 36.51,4.13 | 36.51,4.13 35.24,2.86 27.37,2.86 IC5.3
N$23
  Top 0.254: R2.2 20.96,67.31 24.1,64.16 IC4.13
N$25  (via drill 0.6)
  Top 0.254: R2.1 15.87,67.31 14.6,66.04 1.91,66.04 0.95,66.99 0.95,94.3 8.57,101.92 59.69,101.92 v61.28,100.33
  Bottom 0.254: v61.28,100.33 LED1.A
N$26
  Bottom 0.61: R25.2 16.25,35.31 C15.-
N$28  (via drill 0.6)
  Top 0.61: v21.59,31.12 24.76,31.12 26.67,29.21 AD725.11
  Bottom 0.61: C15.+ 21.21,31.12 v21.59,31.12
N$29  (via drill 0.6)
  Top 0.61: AD725.9 24.13,26.03 22.54,26.03 16.51,32.07 v16.51,39.37
  Bottom 0.61: v16.51,39.37 18.03,40.89 C14.+
N$30
  Bottom 0.61: SVIDEO.4 13.56,41.5 R24.1
N$31
  Bottom 0.61: SVIDEO.3 13.56,34.7 R25.1
PA4  (via drill 0.6)
  Top 0.254: EXT.3 45.09,60.32 45.09,63.5 46.04,64.45 46.67,64.45 47.63,65.4 47.63,66.68 48.26,67.31 51.43,67.31 52.39,68.26 IC6.1 | IC4.33 38.02,55.16 v38.74,55.88
  Bottom 0.254: v38.74,55.88 43.18,55.88 EXT.3
PA5  (via drill 0.6)
  Top 0.254: IC4.32 35.59,54.27 35.88,53.97 38.42,53.97 39.37,54.93 v40.32,54.93
  Bottom 0.254: v40.32,54.93 44.77,54.93 EXT.5
PA6  (via drill 0.6)
  Top 0.254: IC4.31 34.78,54.11 35.56,53.34 38.74,53.34 39.05,53.66 v40.32,53.66
  Bottom 0.254: v40.32,53.66 46.04,53.66 EXT.7
PA7  (via drill 0.6)
  Top 0.254: IC4.30 33.99,53.96 35.24,52.71 39.37,52.71 v40.32,51.75 | v59.37,37.78 v59.37,46.67
  Bottom 0.254: v40.32,51.75 40.64,51.43 EXT.9 46.99,51.43 48.26,50.17 55.88,50.17 v59.37,46.67 | v59.37,37.78 60.01,38.42 63.18,38.42 68.9,32.7 68.9,22.23 53.35,6.68 U$4.GPIO0
PB1  (via drill 0.6)
  Top 0.254: IC4.41 40.34,62.56 40.64,62.86 v41.28,62.86
  Bottom 0.254: EXT.14 48.26,46.35 46.99,47.63 38.74,47.63 34.61,51.75 34.61,58.1 39.37,62.86 v41.28,62.86
PB2  (via drill 0.6)
  Top 0.254: IC4.42 39.86,63.36 40.32,63.82 40.32,64.14 40.64,64.45 v41.28,64.45
  Bottom 0.254: EXT.16 47.63,42.54 45.72,42.54 44.77,43.5 44.77,45.4 43.5,46.67 38.42,46.67 33.65,51.43 33.65,58.42 39.69,64.45 v41.28,64.45
PD3  (via drill 0.6)
  Top 0.254: v24.76,66.04 24.76,65.4 25.21,64.96 IC4.12 | v56.2,37.78 v56.2,46.67
  Bottom 0.254: v24.76,66.04 41.59,66.04 42.54,65.09 42.54,62.23 41.91,61.6 39.69,61.6 35.56,57.47 35.56,52.39 39.05,48.89 EXT.11 46.99,48.89 48.26,47.63 55.56,47.63 56.2,46.99 v56.2,46.67 | U$4.RST 37.86,6.59 39.05,5.4 53.02,5.4 69.53,21.91 69.53,33.02 62.86,39.69 59.69,39.69 57.78,37.78 v56.2,37.78
PD5  (via drill 0.6)
  Top 0.254: IC4.14 23.99,63.36 v23.81,63.18
  Bottom 0.254: EXT.13 47.63,45.09 49.53,45.09 50.17,44.45 50.17,43.18 48.89,41.91 45.4,41.91 44.13,43.18 44.13,45.09 43.18,46.04 37.78,46.04 32.39,51.43 32.39,54.61 v23.81,63.18
POWER_SW
  Top 0.254: IC4.11 28.39,66.87 25.4,69.85 25.4,81.28 27.94,83.82 40.21,83.82 POWER.1 POWER.2
RED  (via drill 0.6)
  Top 0.254: AD725.6 26.67,34.29 26.03,33.65 24.13,33.65 22.86,34.92 v22.86,39.37 22.86,40.32 24.76,42.23 C3.2
  Bottom 0.254: v22.86,39.37 22.86,29.85 29.85,22.86 31.43,22.86 32.07,23.49 32.07,24.76 37.15,29.85 A/V.2
RED0
  Top 0.254: R1.1 22.23,57.78 23.8,59.36 IC4.19
RED1
  Top 0.254: R5.1 24.76,53.66 24.13,54.29 24.13,57.78 24.91,58.56 IC4.20
RED2
  Top 0.254: R6.1 27.3,52.39 25.08,54.61 25.08,57.47 25.4,57.78 26.56,57.78 IC4.21
RESET  (via drill 0.6)
  Top 0.254: IC4.4 33.99,67.96 34.92,68.9 39.69,68.9 v41.28,71.12
  Bottom 0.254: ISP.5 51.75,68.26 51.75,56.83 EXT.8 | v41.28,71.12 42.23,71.12 43.82,72.71 43.82,75.77 RESET.2
  Bottom 0.61: 50.17,75.77 RESET.1 RESET.2
  Bottom 1.016: ISP.5 48.89,74.5 RESET.1
RX_SW
  Bottom 0.61: R4.1 50.8,21.91 IC3.4 50.8,27.94 51.75,28.89 JP1.1
SCK  (via drill 0.6)
  Top 0.254: IC4.3 34.78,67.81 35.24,68.26 40.64,68.26 v41.59,69.53 | R27.2 v21.91,80.01 | ISP.3 48.26,68.58 46.99,67.31 45.72,67.31 44.77,68.26 44.77,71.76 45.72,72.71 54.29,72.71 54.93,73.34 IC6.6
  Bottom 0.254: EXT.6 51.12,58.74 51.12,66.99 49.53,68.58 ISP.3 47.63,69.85 47.63,74.29 46.99,74.93 45.72,74.93 45.09,74.29 45.09,73.03 v41.59,69.53 33.34,69.53 22.86,80.01 v21.91,80.01
SCK_3V3
  Top 0.254: R30.2 R27.1 17.14,80.01 16.51,79.37 16.51,78.74 15.87,78.1 14.97,78.1 U1.5
SD_CE
  Top 0.254: IC4.15 28.27,62.56 28.57,62.86 28.57,64.77 27.3,66.04 27.3,66.68 24.13,69.85 R26.2 19.69,69.85
SD_CE_3V3
  Top 0.254: R26.1 R29.2 17.14,72.39 16.51,73.03 16.51,73.98 15.87,74.61 15.02,74.61 U1.2
SNES_CLK  (via drill 0.6)
  Top 0.254: IC4.34 39.88,56.96 41.28,55.56 41.28,47.31 40.32,46.35 40.32,42.86 v41.91,41.28
  Bottom 0.254: U$2.P2 60.96,90.81 67.95,83.82 67.95,73.98 68.58,73.34 JP4.2 68.58,71.44 66.36,69.21 61.28,69.21 58.74,66.68 58.74,64.67 U$1.P2 60.96,63.5 67.95,56.52 67.95,47.31 68.58,46.67 JP5.2 65.72,41.59 56.83,41.59 55.24,40 43.82,40 42.86,40.96 42.23,40.96 v41.91,41.28
  Bottom 0.406: 60.01,63.6 U$1.P2
SNES_DATA1  (via drill 0.6)
  Top 0.254: IC4.37 40.34,59.36 43.18,56.52 43.18,40 42.86,39.69 v41.91,39.69
  Bottom 0.254: JP4.4 63.5,73.66 64.77,74.93 64.77,79.06 63.18,80.65 U$2.P4 59.37,81.18 59.37,87.95 58.1,89.22 58.1,93.66 60.01,95.57 66.04,95.57 70.48,91.12 70.48,77.47 72.71,75.25 72.71,67.63 70.48,65.4 70.48,48.89 72.71,46.67 72.71,43.5 70.17,40.96 57.15,40.96 55.56,39.37 42.23,39.37 v41.91,39.69
SNES_DATA2  (via drill 0.6)
  Top 0.254: IC4.36 40.18,58.56 42.54,56.2 42.54,46.04 41.91,45.4 v41.91,45.09
  Bottom 0.254: U$1.P4 63.18,53.34 64.77,51.75 64.77,48.26 63.5,46.99 JP5.4 61.91,42.86 56.2,42.86 54.61,41.28 45.09,41.28 43.5,42.86 43.5,44.45 42.86,45.09 v41.91,45.09
SNES_LATCH  (via drill 0.6)
  Top 0.254: IC4.35 40.03,57.76 41.91,55.88 41.91,46.99 40.96,46.04 40.96,43.82 41.28,43.5 v41.91,43.5
  Bottom 0.254: U$2.P3 64.45,85.73 66.68,83.5 66.68,73.98 66.04,73.34 JP4.3 64.45,70.17 60.32,70.17 56.83,66.68 56.83,62.55 60.96,58.42 U$1.P3 64.45,58.42 66.68,56.2 66.68,47.31 66.04,46.67 JP5.3 63.82,42.23 56.52,42.23 54.93,40.64 44.45,40.64 41.91,43.18 v41.91,43.5
UART_RX  (via drill 0.6)
  Top 0.254: IC4.9 29.98,69.71 v28.89,70.8
  Top 0.61: v52.71,37.46 52.71,38.74 50.8,40.64 v50.8,51.43
  Bottom 0.254: EXT.10 48.26,51.43 46.99,52.71 38.1,52.71 37.46,53.34 37.46,56.83 40.96,60.32 43.18,60.32 43.82,60.96 43.82,65.72 42.23,67.31 32.39,67.31 v28.89,70.8
  Bottom 0.61: EXT.10 v50.8,51.43 | v52.71,37.46 52.71,36.83 51.12,35.24 51.12,32.07 51.75,31.43 JP1.2
UART_TX  (via drill 0.6)
  Top 0.254: v28.89,68.9 29.19,68.56 IC4.10 | v57.78,46.67 v57.78,39.69
  Bottom 0.254: v57.78,46.67 57.78,46.99 55.88,48.89 EXT.12 48.26,48.89 46.99,50.17 39.37,50.17 36.51,53.02 36.51,57.15 40.32,60.96 42.54,60.96 43.18,61.6 43.18,65.4 41.91,66.68 31.12,66.68 v28.89,68.9 | v57.78,39.69 58.42,40.32 63.18,40.32 70.17,33.34 70.17,21.59 52.72,4.14 U$4.RX
VIDEO_CE
  Top 0.254: AD725.5 27.94,29.85 28.57,29.21 28.57,24.13 30.48,22.23 42.86,22.23 44.45,23.81 44.45,38.42 45.09,39.05 45.09,59.37 44.45,60.01 44.45,64.45 42.86,66.04 40,66.04 39.05,65.09 38.31,65.09 IC4.44
VIDEO_CLK  (via drill 0.6)
  Top 0.254: AD725.3 30.48,29.85 29.85,29.21 29.85,24.76 v30.48,24.13 31.75,22.86 42.54,22.86 43.82,24.13 43.82,38.74 44.45,39.37 44.45,59.06 43.82,59.69 43.82,64.14 42.54,65.4 40.64,65.4 39.37,64.14 38.21,64.14 IC4.43
  Bottom 0.254: A/V.5 48.89,34.29 47.63,33.02 47.63,31.75 46.99,31.12 36.2,31.12 30.48,25.4 v30.48,24.13
VIDEO_SYNC  (via drill 0.6)
  Top 0.254: AD725.16 33.02,24.76 v33.65,24.13 34.29,23.49 42.23,23.49 43.18,24.45 43.18,39.05 43.82,39.69 43.82,58.74 43.18,59.37 43.18,60.64 42.06,61.76 IC4.40
  Bottom 0.254: A/V.3 48.89,31.75 47.63,30.48 47.63,29.21 46.99,28.57 38.1,28.57 v33.65,24.13
(copper drawn outside any net)
  shapes: Top area x1

### Text on the board
Top: TOP | Ivan Ignáth 2016 | based on UZEBox
Bottom: BOTTOM